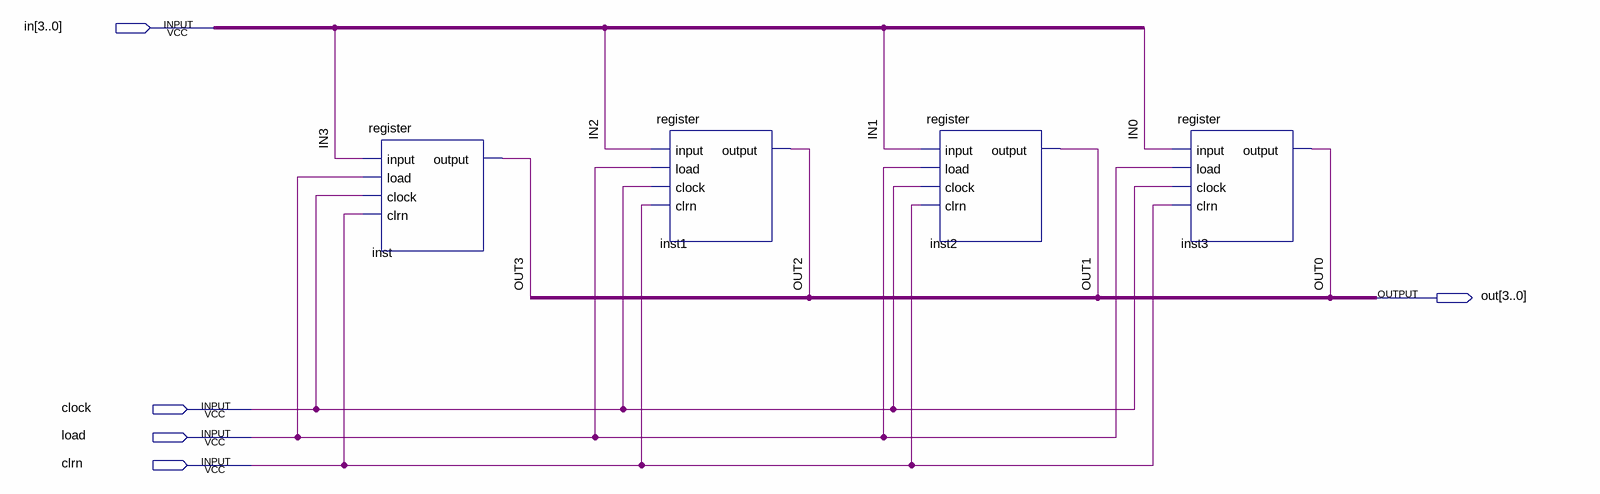
[diagram p0: schematic sheet]
// Quartus schematic reg4.bdf as structural Verilog: 4 symbols, 5 pins
module reg4 (
  input  [3:0] in,
  input  clock,
  input  load,
  input  clrn,
  output [3:0] out
);

  register inst (.\input (in[3]), .load(load), .clock(clock), .clrn(clrn), .\output (out[3]));
  register inst1 (.\input (in[2]), .load(load), .clock(clock), .clrn(clrn), .\output (out[2]));
  register inst2 (.\input (in[1]), .load(load), .clock(clock), .clrn(clrn), .\output (out[1]));
  register inst3 (.\input (in[0]), .load(load), .clock(clock), .clrn(clrn), .\output (out[0]));
endmodule
